# Altium schematic sheet SPI Flash.SchDoc: SPI Flash
size B; CompanyName: Cospan Design; DrawnBy: David McCoy; Engineer: David McCoy; DocumentNumber: 3; SheetNumber: 3; SheetTotal: 8
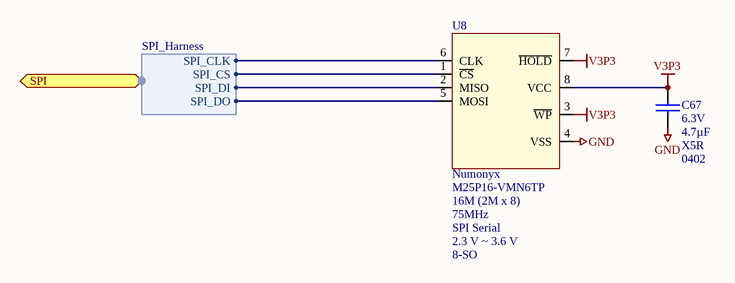
[diagram p0: SPI Flash.SchDoc]

## Parts
C67  Voltage - Rated: 6.3V  Capacitance: 4.7µF  Temperature Coefficient: X5R  Package / Case: 0402  [C_ERA-0402]  (hidden comment: 4.7uF)
U8  Manufacturer: Numonyx  Manufacturer Part Number: M25P16-VMN6TP  Memory Size: 16M (2M x 8)  Speed: 75MHz  Interface: SPI Serial  Voltage - Supply: 2.3 V ~ 3.6 V  Supplier Device Package: 8-SO  [SOIC127P600X135-8L]  (hidden comment: U_16MBIT_SPI_FLASH)

## Ports
SPI (harness SPI_Harness)

## Harnesses
SPI_Harness: SPI_CLK, SPI_DO, SPI_DI, SPI_CS

## Nets
GND: C67.1 U8.4(VSS)
V3P3: C67.2 U8.3(~{WP}) U8.7(~{HOLD}) U8.8(VCC)
NetU8_1: U8.1(~{CS}) ; port SPI.SPI_CS
NetU8_2: U8.2(MISO) ; port SPI.SPI_DI
NetU8_5: U8.5(MOSI) ; port SPI.SPI_DO
NetU8_6: U8.6(CLK) ; port SPI.SPI_CLK

## Notes on the sheet
- Title:
- http://www.cospandesign.com
- Cospan Design
- Project:
- Document:
- Engineer:
- Drawn By:
- Approved By:
- Revision:
- Date:
- Number:
- of

## Library data of the parts
C67 = C_0402_4.7UF: CAP CER 4.7UF 6.3V X5R 0402; Manufacturer: Murata Electronics North America; Manufacturer Part Number: GRM155R60J475ME87D; Tolerance: ±20%; Supplier 1: Digi-Key; Supplier Part Number 1: 445-7395-1-ND; RoHS: RoHS Compliant; Category: Capacitors; Stock 1: 1176918; Pricing: 1=0.46, 10=0.365, 50=0.264, 100=0.22, 250=0.165, 500=0.1408, 1000=0.11, 5000=0.0836 (USD); Mounting Type: Surface Mount, MLCC; Operating Temperature: -55°C ~ 85°C; Applications: General Purpose; Ratings: -; Size / Dimension: 0.039" L x 0.020" W (1.00mm x 0.50mm); Height: -; Thickness: 0.022" (0.55mm); Lead Spacing: -; Features: -; Packaging: Cut Tape (CT); Lead Style: -; ComponentLink1URL: http://www.murata.com/products/catalog/pdf/c02e.pdf; ComponentLink1Description: http://www.murata.com/products/catalog/pdf/c02e.pdf; Stock 2: 8098; Pricing 2: 1=0.32, 10=0.28, 100=0.14, 250=0.112, 500=0.102, 1000=0.092, 5000=0.076 (USD); Height - Seated (Max): -; Thickness (Max): 0.026" (0.65mm); ComponentLink2URL: http://www.tdk.com/pdf/general_B11.pdf; ComponentLink2Description: http://www.tdk.com/pdf/general_B11.pdf
U8 = U_16MBIT_SPI_FLASH: IC FLASH 16MBIT 75MHZ 8SOIC; Memory Type: FLASH - Nor; Supplier 1: Digi-Key; Supplier Part Number 1: M25P16-VMN6TPCT-ND; RoHS: RoHS Compliant; Category: Integrated Circuits (ICs); Stock 1: 0; Pricing: 1=1.17, 10=1.062, 25=1.0488, 50=1.0428, 100=0.9322, 250=0.92436, 500=0.91066, 1000=0.87785 (USD); Format - Memory: FLASH; Operating Temperature: -40°C ~ 85°C; Package / Case: 8-SOIC (0.154", 3.90mm Width); Packaging: Cut Tape (CT); ComponentLink1URL: http://media.digikey.com/pdf/Data%20Sheets/Numonyx,Intel/M25P16.pdf; ComponentLink1Description: http://media.digikey.com/pdf/Data%20Sheets/Numonyx,Intel/M25P16.pdf